# EAGLE schematic Slave - unfinished (EAGLE 7.4.0)
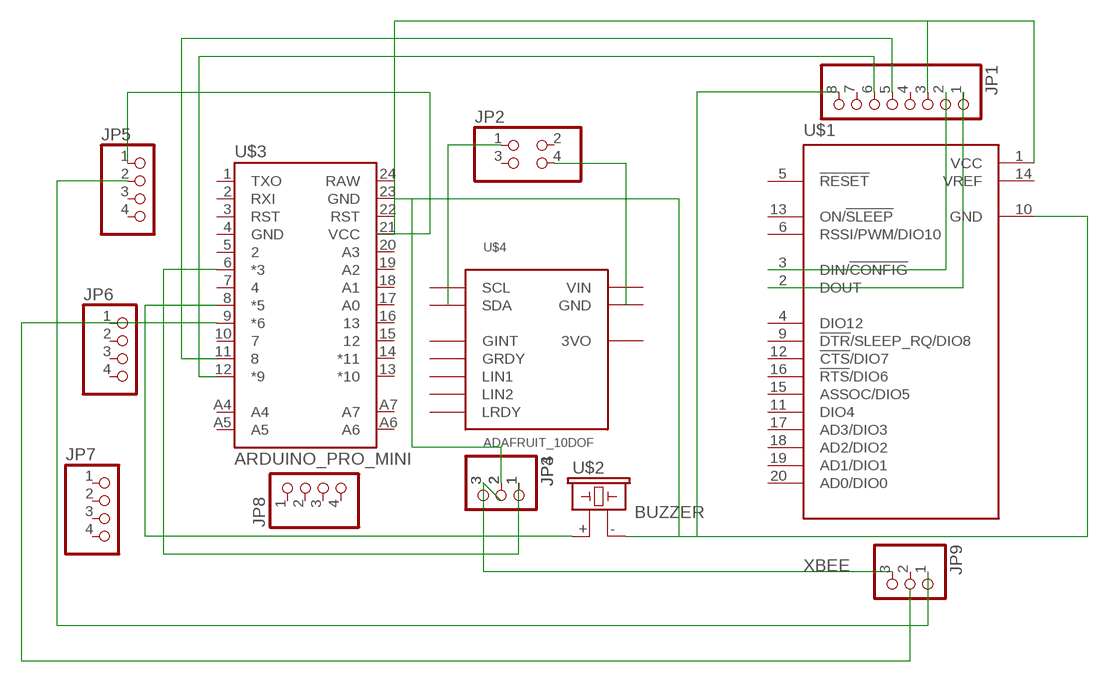
[diagram p0: schematic, sheet 1]

## Parts
JP1  PINHD-1X8  [1X08]
JP2  PINHD-2X2  [2X02]
JP3  PINHD-1X3  [1X03]
JP4  PINHD-1X3  [1X03]
JP5  PINHD-1X4  [1X04]
JP6  PINHD-1X4  [1X04]
JP7  PINHD-1X4  [1X04]
JP8  PINHD-1X4  [1X04]
JP9  PINHD-1X3  [1X03]
U$1  XBEE  [XBEE]
U$2  BUZZER  [BUZZER]
U$3  ARDUINO_PRO_MINI  [ARDUINO_PRO_MINI]
U$4  ADAFRUIT_10DOF  [ADAFRUIT_10DOF]

## Nets
N$1: U$2.+ U$3.8(*5)
N$2: JP1.5 U$3.11
N$3: JP3.1 JP4.1 U$3.6(*3)
N$4: JP1.8 JP3.2 JP4.2 U$1.10(GND) U$2.- U$3.23(GND)
N$5: JP9.3
N$6: JP3.3 JP4.3
N$7: JP1.6 U$3.12(*9)
N$8: JP5.2 JP9.1
N$9: JP1.3 JP5.1 U$1.1(VCC) U$3.21(VCC)
N$10: JP2.1
N$11: JP2.4
N$12: JP1.1 U$1.2(DOUT)
N$13: JP1.2 U$1.3(DIN/!CONFIG)
N$14: U$3.9(*6)
Unconnected: JP1.4 JP1.7 JP2.2 JP2.3 JP5.3 JP5.4 JP6.1 JP6.2 JP6.3 JP6.4 JP7.1 JP7.2 JP7.3 JP7.4 JP8.1 JP8.2 JP8.3 JP8.4 JP9.2 U$1.4(DIO12) U$1.5(!RESET) U$1.6(RSSI/PWM/DIO10) U$1.9(!DTR!/SLEEP_RQ/DIO8) U$1.11(DIO4) U$1.12(!CTS!/DIO7) U$1.13(ON/!SLEEP) U$1.14(VREF) U$1.15(ASSOC/DIO5) U$1.16(!RTS!/DIO6) U$1.17(AD3/DIO3) U$1.18(AD2/DIO2) U$1.19(AD1/DIO1) U$1.20(AD0/DIO0) U$3.1(TXO) U$3.2(RXI) U$3.3(RST) U$3.4(GND) U$3.5 U$3.7 U$3.10 U$3.13(*10) U$3.14(*11) U$3.15 U$3.16 U$3.17(A0) U$3.18(A1) U$3.19(A2) U$3.20(A3) U$3.22(RST) U$3.24(RAW) U$3.A4 U$3.A5 U$3.A6 U$3.A7 U$4.GINT U$4.GRDY U$4.LIN1 U$4.LIN2 U$4.LRDY U$4.SCL U$4.SDA

## Power pins joined to a net without a drawn wire
3VO: U$4.3VO
GND: U$4.GND
VIN: U$4.VIN

## Library data of the parts
JP1 = pinhead:PINHD-1X8: PIN HEADER
JP2 = pinhead:PINHD-2X2: PIN HEADER
JP3 JP4 JP9 = pinhead:PINHD-1X3: PIN HEADER
JP5-JP8 = pinhead:PINHD-1X4: PIN HEADER
U$1 = CANSat:XBEE
U$2 = CANSat:BUZZER
U$3 = CANSat:ARDUINO_PRO_MINI
U$4 = CANSat:ADAFRUIT_10DOF